# Altium schematic sheet TeensyIMULite.SchDoc: Crash Stick: IMU and High G for Teensy
size Letter; Author: Jeremy Daily; Organization: Mechanical Engineering; Address1: The University of Tulsa; Address2: 800 S. Tucker Dr; Address3: Tulsa, OK 74104; Revision: 1; SheetNumber: 1; SheetTotal: 1
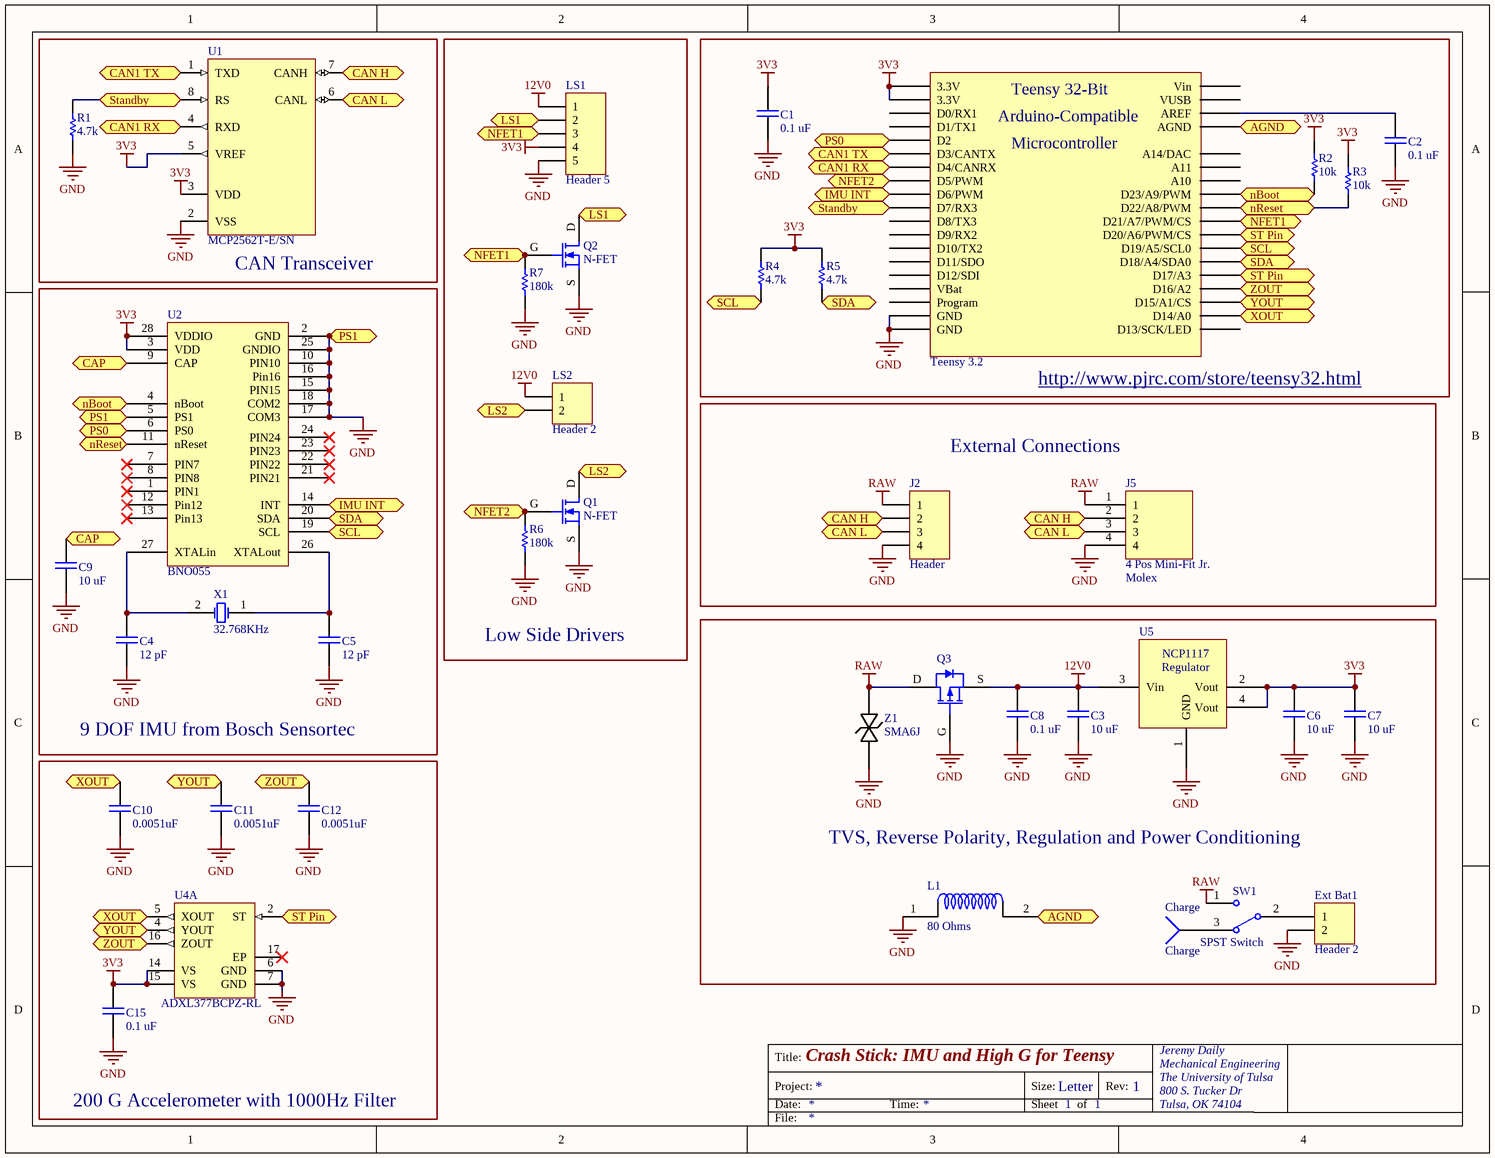
[diagram p0: TeensyIMULite.SchDoc]

## Parts
BRD1  Teensy 3.2  [Teensy]
C1  0.1 uF  [0603]
C2  0.1 uF  [0603]
C3  10 uF  [0603]
C4  12 pF  [0603]
C5  12 pF  [0603]
C6  10 uF  [0603]
C7  10 uF  [0603]
C8  0.1 uF  [0603]
C9  10 uF  [0603]
C10  0.0051uF  [0603]
C11  0.0051uF  [0603]
C12  0.0051uF  [0603]
C15  0.1 uF  [0603]
Charge  Charge  [PIN1]
Ext_Bat1  Header 2  [HDR1X2]
J2  Header  [HDR1X4]
J5  4 Pos Mini-Fit Jr.  Manufacturer: Molex  [4 POS MINI-FIT JR]
L1  80 Ohms  [0805]
LS1  Header 5  [HDR1X5]
LS2  Header 2  [HDR1X2]
Q1  N-FET  [SOT-23-3]
Q2  N-FET  [SOT-23-3]
Q3  P-FET  [SOT-23-3]  (value not drawn)
R1  4.7k  [0603]
R2  10k  [0603]
R3  10k  [0603]
R4  4.7k  [0603]
R5  4.7k  [0603]
R6  180k  [0603]
R7  180k  [0603]
SW1  SPST Switch  [Slide Switch R/A]
U1  MCP2562T-E/SN  [SOIC-SN8_M]
U2  BNO055  [BNO055 LGA]
U4  ADXL377BCPZ-RL  [ADI-CP-16-28_N]  (part A of 2)
U5  LDO1117  [SOT-223]  (value not drawn)
X1  32.768KHz  [XTAL 2 pad]
Z1  SMA6J  [SMA]

## Blocks framed on the sheet
CAN Transceiver: R1 U1
Low Side Drivers: LS1 LS2 Q1 Q2 R6 R7
http://www.pjrc.com/store/teensy32.html: BRD1 C1 C2 R2-R5
9 DOF IMU from Bosch Sensortec: C4 C5 C9 U2 X1
TVS, Reverse Polarity, Regulation and Power Conditioning: C3 C6-C8 Charge Ext_Bat1 L1 Q3 SW1 U5 Z1
200 G Accelerometer with 1000Hz Filter: C10-C12 C15 U4

## Ports
AGND, CAN1 RX, CAN1 TX, CAN H, CAN L, CAP, IMU INT, LS1, LS2, nBoot, NFET1, NFET2, nReset, PS0, PS1, SCL, SDA, ST Pin, Standby, XOUT, YOUT, ZOUT

## Nets
3V3: BRD1.16(3.3V) BRD1.31(3.3V) C1.2 C6.2 C7.2 C15.2 LS1.4 R2.1 R3.1 R4.1 R5.1 U1.3(VDD) U1.5(VREF) U2.3(VDD) U2.28(VDDIO) U4.14(VS) U4.15(VS) U5.2(Vout) U5.4(Vout)
12V0: C3.2 C8.2 LS1.1 LS2.1 Q3.S U5.3(Vin)
GND: BRD1.14(GND) BRD1.17(GND) C1.1 C2.1 C3.1 C4.1 C5.1 C6.1 C7.1 C8.1 C9.1 C10.1 C11.1 C12.1 C15.1 Ext_Bat1.2 J2.4 J5.4 L1.1 LS1.5 Q1.S(Source) Q2.S(Source) Q3.G R1.1 R6.2 R7.2 U1.2(VSS) U2.2(GND) U2.5(PS1) U2.10(PIN10) U2.15(PIN15) U2.16(Pin16) U2.17(COM3) U2.18(COM2) U2.25(GNDIO) U4.6(GND) U4.7(GND) U5.1(GND) Z1.1(A) ; port PS1
RAW: J2.1 J5.1 Q3.D SW1.1 Z1.2(K)
AGND: BRD1.32(AGND) L1.2 ; port AGND
CAN1 RX: BRD1.9(D4/CANRX) U1.4(RXD) ; port CAN1 RX
CAN1 TX: BRD1.10(D3/CANTX) U1.1(TXD) ; port CAN1 TX
CAN H: J2.2 J5.2 U1.7(CANH) ; port CAN H
CAN L: J2.3 J5.3 U1.6(CANL) ; port CAN L
CAP: C9.2 U2.9(CAP) ; port CAP
IMU INT: BRD1.7(D6/PWM) U2.14(INT) ; port IMU INT
LS1: LS1.2 Q2.D(Drain) ; port LS1
LS2: LS2.2 Q1.D(Drain) ; port LS2
nBoot: BRD1.30(D23/A9/PWM) R2.2 U2.4(nBoot) ; port nBoot
NFET1: BRD1.28(D21/A7/PWM/CS) LS1.3 Q2.G(Gate) R7.1 ; port NFET1
NFET2: BRD1.8(D5/PWM) Q1.G(Gate) R6.1 ; port NFET2
nReset: BRD1.29(D22/A8/PWM) R3.2 U2.11(nReset) ; port nReset
PS0: BRD1.11(D2) U2.6(PS0) ; port PS0
SCL: BRD1.26(D19/A5/SCL0) R4.2 U2.19(SCL) ; port SCL
SDA: BRD1.25(D18/A4/SDA0) R5.2 U2.20(SDA) ; port SDA
ST Pin: BRD1.24(D17/A3) BRD1.27(D20/A6/PWM/CS) U4.2(ST) ; port ST Pin
Standby: BRD1.6(D7/RX3) R1.2 U1.8(RS) ; port Standby
XOUT: BRD1.21(D14/A0) C10.2 U4.5(XOUT) ; port XOUT
YOUT: BRD1.22(D15/A1/CS) C11.2 U4.4(YOUT) ; port YOUT
ZOUT: BRD1.23(D16/A2) C12.2 U4.16(ZOUT) ; port ZOUT
NetBRD1_35: BRD1.35(AREF) C2.2
NetC4_2: C4.2 U2.27(XTALin) X1.2(OSC2)
NetC5_2: C5.2 U2.26(XTALout) X1.1(OSC1)
NetCharge_1: Charge.1 SW1.3
NetExt_Bat1_1: Ext_Bat1.1 SW1.2

Not connected (* = marked no-connect by the designer): BRD1 1(D12/SDI) 2(D11/SDO) 3(D10/TX2) 4(D9/RX2) 5(D8/TX3) 12(D1/TX1) 13(D0/RX1) 15(VBat) 18(Program) 19(A14/DAC) 20(D13/SCK/LED) 33(Vin) 34(VUSB) 36(A10) 37(A11); U2 1(PIN1)* 7(PIN7)* 8(PIN8)* 12(Pin12)* 13(Pin13)* 21(PIN21)* 22(PIN22)* 23(PIN23)* 24(PIN24)*; U4 17(EP)*

## Notes on the sheet
- External Connections
- Title:
- Project:
- Date:
- Time:
- Sheet
- Size:
- Letter
- of
- Rev:
- File:
- (in symbol NCP1117 2.5V) NCP1117; Regulator
- (in symbol Teensy) Teensy 32-Bit; Arduino-Compatible; Microcontroller

## Library data of the parts
BRD1 = Teensy: 32 Bit Arduino-Compatible Microcontroller; Manufacturer: PRJC; PartNumber: Teensy 3.2; Supplier 1: Sparkfun; Supplier Part Number 1: DEV-13736; Supplier 2: OSH Park
C1 C2 C8 C15 = Cap: CAP CER 0.1UF 50V X7R 0603; Manufacturer: Murata Electronics North America; PartNumber: GRM188R71H104KA93D; Supplier 1: Digi-Key; Supplier Part Number 1: 490-1519-1-ND; Supplier 2: Mouser; Supplier Part Number 2: 81-GRM39X104K50D
C3 C6 C7 C9 = Cap: CAP CER 10UF 25V X5R 0603; Manufacturer: Murata Electronics North America; PartNumber: GRM188R61E106MA73D; Supplier 1: Digi-Key; Supplier Part Number 1: 490-7202-1-ND; Supplier 2: Mouser; Supplier Part Number 2: 81-GRM188R61E106MA3D
C4 C5 = Cap: CAP CER 12PF 50V NP0 0603; Manufacturer: Murata Electronics North America; PartNumber: GRM1885C1H120JA01D; Supplier 1: Digi-Key; Supplier Part Number 1: 490-1405-1-ND; Supplier 2: Mouser; Supplier Part Number 2: 81-GRM39C120J50
C10-C12 = Cap: CAP CER 5100PF 50V U2J 0603; Manufacturer: Murata Electronics North America; PartNumber: GRM1887U1H512JA01D; Supplier 1: Digi-Key; Supplier Part Number 1: 490-6399-1-ND; Supplier 2: Mouser; Supplier Part Number 2: 81-GRM1887U1H512JA1D
Charge = Socket: Supplier 2: Mouser
Ext_Bat1 LS2 = Header 2: Header, 2-Pin; Supplier 2: Mouser
J2 = Header 4: Header, 4-Pin; Supplier 2: Mouser
J5 = 4 Pos Header Vert: CONN HEADER 4POS 4.2MM R/A TIN; Supplier 1: Digi-Key; Supplier 2: Mouser; PartNumber: 39-30-0040; Supplier Part Number 1: WM21352-ND; Supplier Part Number 2: 538-39-30-0040
L1 = Ferrite Bead: Ferrite Bead 80ohms 100MHz 5A Monolithic 0805 SMD; Manufacturer: Laird Technologies; PartNumber: HI0805R800R-10; Supplier 1: Mouser; Supplier Part Number 1: 875-HI0805R800R-10; Supplier 2: Mouser; Supplier Part Number 2: 875-HI0805R800R-10
LS1 = Header 5: Header, 5-Pin; Supplier 2: Mouser
Q1 Q2 = N-FET IRLML6344TRPbF: IC INDCT LOAD DRVR AUTO SOT23; Manufacturer: ON Semiconductor; PartNumber: NUD3124LT1G; Supplier 1: Digi-Key; Supplier Part Number 1: NUD3124LT1GOSCT-ND; Supplier 2: Mouser; Supplier Part Number 2: 863-SZNUD3124LT1G
Q3 = P-FET: MOSFET P-CH 30V 4.3A SOT23; Manufacturer: Alpha & Omega Semiconductor Inc.; PartNumber: AO3407A; Supplier 1: Digi-Key; Supplier Part Number 1: 785-1006-1-ND; Supplier 2: Mouser; Supplier Part Number 2: 942-IRLML9301TRPBF
R1 R4 R5 = Chip Resistor: RES SMD 4.7K OHM 1% 1/10W 0603; Manufacturer: Panasonic Electronic Components; PartNumber: ERJ-3EKF4701V; Supplier 1: Digi-Key; Supplier Part Number 1: P4.70KHCT-ND; Supplier 2: Mouser; Supplier Part Number 2: 667-ERJ-3EKF4701V
R2 R3 = Chip Resistor: RES SMD 10K OHM 1% 1/10W 0603; Manufacturer: Panasonic Electronic Components; PartNumber: ERJ-3EKF1002V; Supplier 1: Digi-Key; Supplier Part Number 1: P10.0KHCT-ND; Supplier 2: Mouser; Supplier Part Number 2: 667-ERJ-3EKF1002V
R6 R7 = Chip Resistor: RES SMD 180K OHM 1% 1/10W 0603; Manufacturer: Panasonic Electronic Components; PartNumber: ERJ-3EKF1803V; Supplier 1: Digi-Key; Supplier Part Number 1: P180KHCT-ND; Supplier 2: Mouser; Supplier Part Number 2: 667-ERJ-3EKF1803V
SW1 = SPDT Slide Switch: SWITCH SLIDE SPDT 200MA 30V; Manufacturer: TE Connectivity AMP Connectors; PartNumber: 1825232-1; Supplier 1: Digi-Key; Supplier Part Number 1: A107673-ND; Supplier 2: Mouser; Supplier Part Number 2: 655-1825232-1
U1 = MCP2551T-E/SN: High-Speed CAN Transceiver, 8-Pin SOIC, Extended Temperature, Tape and Reel; Manufacturer: Microchip; Supplier 1: Digi-Key; Supplier Part Number 1: MCP2562T-E/SNCT-ND; Supplier Part Number 2: 579-MCP2562T-E/SN; PartNumber: MCP2562T-E/SN; Supplier 2: Mouser
U2 = BNO055: IMUs - Inertial Measurement Units Absolute Orientation 9-Axis Sensor; Manufacturer: Bosch Sensortec; PartNumber: BNO055; Supplier 1: Digi-Key; Supplier 2: Mouser; Supplier Part Number 2: 262-BNO055
U4 = ADXL377BCPZ-RL: 3-Axis, +/-200 g Analog MEMS Accelerometer with Analog Output, 1.3 KHz BW, Industrial, 16-pin QFN, Reel; Manufacturer: Analog Devices; Supplier 1: Digi-Key; Supplier Part Number 1: ADXL377BCPZ-RL-ND; Supplier 2: Mouser; Supplier Part Number 2: 584-ADXL377BCPZ-R7; PartNumber: ADXL377BCPZ-RL
U5 = NCP1117 2.5V: IC REG LDO 3.3V 1A SOT223-3; Manufacturer: Diodes Incorporated; PartNumber: ZLDO1117G33TA; Supplier 1: Digi-Key; Supplier Part Number 1: ZLDO1117G33DICT-ND; Supplier 2: Mouser; Supplier Part Number 2: 522-ZLDO1117G33TA
X1 = Crystal Oscillator: Crystal 32.7680kHz 20ppm 12.5pF 70 kOhm -40°C - 85°C Surface Mount 2-SMD; Manufacturer: ECS Inc.; PartNumber: ECS-.327-12.5-39-TR; Supplier 1: Digi-Key; Supplier Part Number 1: XC1658CT-ND; Supplier 2: Mouser; Supplier Part Number 2: 520-.327-12.5-39-TR
Z1 = Zener - Bidirectional: TVS DIODE 15VWM 24.4VC SMA; Manufacturer: Micro Commercial Co; PartNumber: SMA6J15CA-TP; Supplier 1: Digi-Key; Supplier Part Number 1: SMA6J15CA-TPMSCT-ND; Supplier 2: Mouser; Supplier Part Number 2: 833-SMA6J15CA-TP